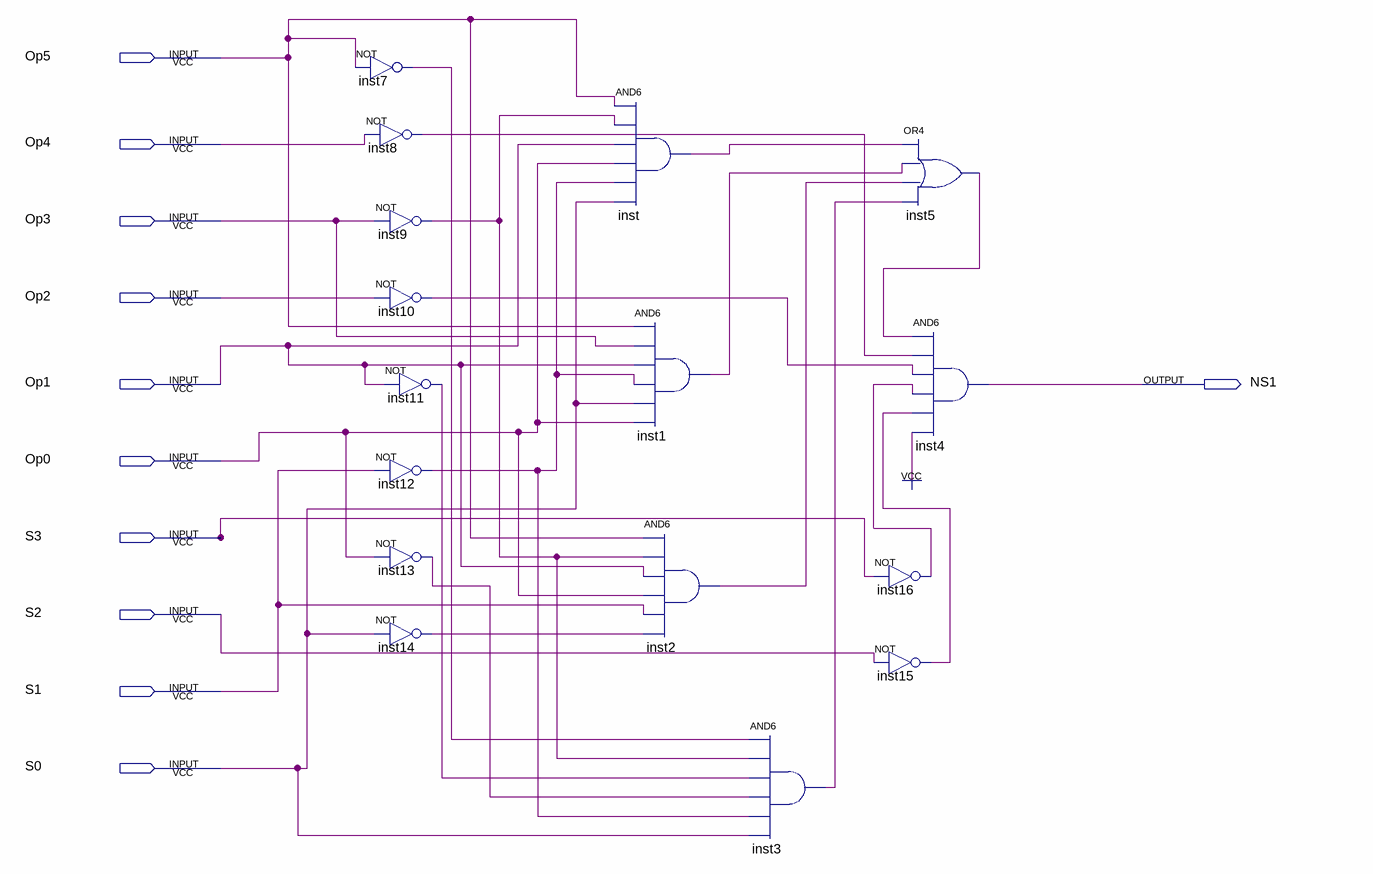
[diagram p0: schematic sheet]
// Quartus schematic NS1.bdf as structural Verilog: 16 symbols, 11 pins
module NS1 (
  input  Op5,
  input  Op4,
  input  Op3,
  input  Op2,
  input  Op1,
  input  Op0,
  input  S3,
  input  S2,
  input  S1,
  input  S0,
  output NS1
);

  wire inst1_out, inst2_out, inst3_out, inst5_out, inst7_out, inst8_out, inst9_out, inst10_out, inst11_out,
       inst12_out, inst13_out, inst14_out, inst15_out, inst16_out, inst_out;

  not inst7 (inst7_out, Op5);
  not inst8 (inst8_out, Op4);
  not inst9 (inst9_out, Op3);
  not inst10 (inst10_out, Op2);
  not inst12 (inst12_out, S1);
  not inst13 (inst13_out, Op0);
  not inst14 (inst14_out, S0);
  not inst11 (inst11_out, Op1);
  and inst (inst_out, Op5, inst9_out, Op1, Op0, inst12_out, S0);
  and inst1 (inst1_out, Op5, Op3, Op1, inst12_out, S0, Op0);
  and inst2 (inst2_out, Op5, inst9_out, Op1, Op0, S1, inst14_out);
  and inst3 (inst3_out, inst7_out, inst9_out, inst11_out, inst13_out, inst12_out, S0);
  or inst5 (inst5_out, inst_out, inst1_out, inst2_out, inst3_out);
  and inst4 (NS1, inst5_out, inst8_out, inst10_out, inst16_out, inst15_out, 1'b1);
  not inst16 (inst16_out, S3);
  not inst15 (inst15_out, S2);
endmodule
